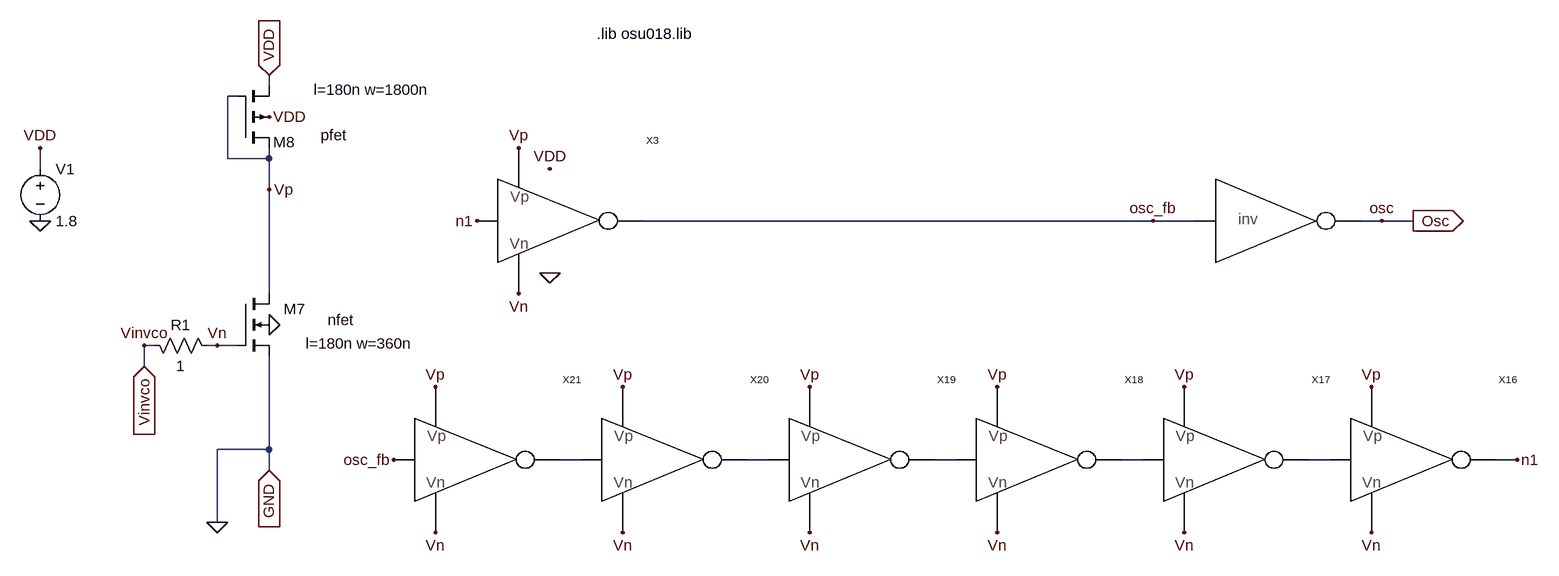
[diagram p0: schematic vco_19_16.asc]
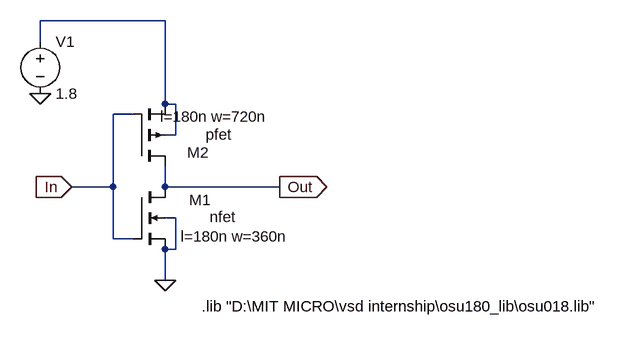
[diagram p1: sub-circuit inv_20_10.asc]
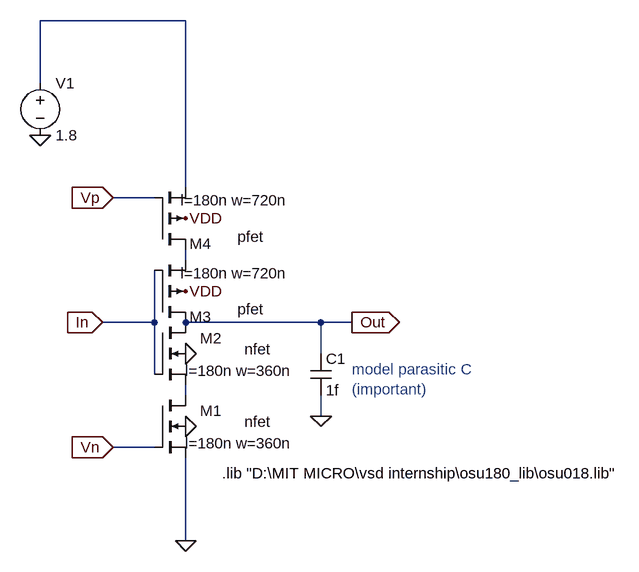
[diagram p2: sub-circuit cs_inv.asc]
vco_19_16.asc, the LTspice schematic file:
Version 4
SHEET 1 6288 680
WIRE 816 -976 816 -992
WIRE 768 -960 752 -960
WIRE 752 -864 752 -960
WIRE 816 -864 816 -880
WIRE 816 -864 752 -864
WIRE 464 -848 464 -880
WIRE 816 -816 816 -864
WIRE 2176 -768 1392 -768
WIRE 2240 -768 2176 -768
WIRE 2528 -768 2496 -768
WIRE 2576 -768 2528 -768
WIRE 816 -656 816 -816
WIRE 640 -576 624 -576
WIRE 736 -576 720 -576
WIRE 768 -576 736 -576
WIRE 624 -544 624 -576
WIRE 816 -416 816 -560
WIRE 816 -416 736 -416
WIRE 1296 -400 1264 -400
WIRE 1584 -400 1552 -400
WIRE 1872 -400 1840 -400
WIRE 2160 -400 2128 -400
WIRE 2448 -400 2416 -400
WIRE 2736 -400 2704 -400
WIRE 816 -384 816 -416
WIRE 736 -304 736 -416
FLAG 624 -576 Vinvco
FLAG 816 -608 0
FLAG 816 -928 VDD
FLAG 816 -816 Vp
FLAG 1072 -512 Vp
FLAG 1072 -288 Vn
FLAG 736 -576 Vn
FLAG 1360 -512 Vp
FLAG 1360 -288 Vn
FLAG 1648 -512 Vp
FLAG 1648 -288 Vn
FLAG 1936 -512 Vp
FLAG 1936 -288 Vn
FLAG 2224 -512 Vp
FLAG 2224 -288 Vn
FLAG 2512 -512 Vp
FLAG 2512 -288 Vn
FLAG 1248 -848 VDD
FLAG 1248 -688 0
FLAG 1200 -880 Vp
FLAG 1200 -656 Vn
FLAG 2528 -768 osc
FLAG 2176 -768 osc_fb
FLAG 1008 -400 osc_fb
FLAG 2736 -400 n1
FLAG 1136 -768 n1
FLAG 816 -992 VDD
IOPIN 816 -992 In
FLAG 816 -384 GND
IOPIN 816 -384 In
FLAG 624 -544 Vinvco
IOPIN 624 -544 In
FLAG 2576 -768 Osc
IOPIN 2576 -768 Out
FLAG 464 -768 0
FLAG 464 -880 VDD
FLAG 736 -304 0
SYMBOL nmos4 768 -656 R0
WINDOW 0 104 24 Right 2
WINDOW 3 179 41 Right 2
WINDOW 123 270 77 Right 2
SYMATTR InstName M7
SYMATTR Value nfet
SYMATTR Value2 l=180n w=360n
SYMBOL pmos4 768 -880 M180
WINDOW 0 88 9 Right 2
WINDOW 3 168 20 Right 2
WINDOW 123 296 90 Right 2
SYMATTR InstName M8
SYMATTR Value pfet
SYMATTR Value2 l=180n w=1800n
SYMBOL res 736 -560 M270
WINDOW 0 32 56 VTop 2
WINDOW 3 0 56 VBottom 2
SYMATTR InstName R1
SYMATTR Value 1
SYMBOL INV_20_10 2272 -832 R0
WINDOW 0 0 0 Invisible 0
SYMATTR InstName U22
SYMBOL CS_inv 1168 -832 R0
SYMATTR InstName X3
SYMBOL CS_inv 2480 -464 R0
SYMATTR InstName X16
SYMBOL CS_inv 2192 -464 R0
SYMATTR InstName X17
SYMBOL CS_inv 1904 -464 R0
SYMATTR InstName X18
SYMBOL CS_inv 1616 -464 R0
SYMATTR InstName X19
SYMBOL CS_inv 1328 -464 R0
SYMATTR InstName X20
SYMBOL CS_inv 1040 -464 R0
SYMATTR InstName X21
SYMBOL voltage 464 -864 R0
WINDOW 123 0 0 Left 0
WINDOW 39 0 0 Left 0
SYMATTR InstName V1
SYMATTR Value 1.8
TEXT 1320 -1056 Left 2 !.lib osu018.lib

inv_20_10.asc, the sub-circuit schematic file:
Version 4
SHEET 1 1196 680
WIRE 448 -432 256 -432
WIRE 256 -400 256 -432
WIRE 448 -304 448 -432
WIRE 464 -304 448 -304
WIRE 400 -288 368 -288
WIRE 464 -256 464 -304
WIRE 464 -256 448 -256
WIRE 368 -176 368 -288
WIRE 368 -176 304 -176
WIRE 448 -176 448 -208
WIRE 624 -176 448 -176
WIRE 464 -128 448 -128
WIRE 368 -96 368 -176
WIRE 400 -96 368 -96
WIRE 464 -80 464 -128
WIRE 464 -80 448 -80
WIRE 448 -32 448 -80
FLAG 304 -176 In
IOPIN 304 -176 In
FLAG 624 -176 Out
IOPIN 624 -176 Out
FLAG 448 -32 0
FLAG 256 -320 0
SYMBOL nmos4 400 -176 R0
WINDOW 0 119 20 Right 2
WINDOW 3 157 46 Right 2
WINDOW 123 238 76 Right 2
SYMATTR InstName M1
SYMATTR Value nfet
SYMATTR Value2 l=180n w=360n
SYMBOL pmos4 400 -208 M180
WINDOW 0 116 21 Right 2
WINDOW 3 151 49 Right 2
WINDOW 123 206 76 Right 2
SYMATTR InstName M2
SYMATTR Value pfet
SYMATTR Value2 l=180n w=720n
SYMBOL voltage 256 -416 R0
WINDOW 123 0 0 Left 0
WINDOW 39 0 0 Left 0
SYMATTR InstName V1
SYMATTR Value 1.8
TEXT 504 8 Left 2 !.lib "D:\\MIT MICRO\\vsd internship\\osu180_lib\\osu018.lib"

cs_inv.asc, the sub-circuit schematic file:
Version 4
SHEET 1 6288 680
WIRE 656 -752 432 -752
WIRE 432 -656 432 -752
WIRE 656 -496 656 -752
WIRE 608 -480 544 -480
WIRE 656 -384 656 -400
WIRE 608 -288 608 -368
WIRE 608 -288 528 -288
WIRE 864 -288 656 -288
WIRE 912 -288 864 -288
WIRE 864 -240 864 -288
WIRE 608 -208 608 -288
WIRE 656 -176 656 -192
WIRE 864 -144 864 -176
WIRE 608 -96 544 -96
WIRE 656 48 656 -80
FLAG 656 -128 0
FLAG 656 -448 VDD
FLAG 656 -336 VDD
FLAG 656 -240 0
FLAG 528 -288 In
IOPIN 528 -288 In
FLAG 544 -480 Vp
IOPIN 544 -480 In
FLAG 544 -96 Vn
IOPIN 544 -96 In
FLAG 912 -288 Out
IOPIN 912 -288 Out
FLAG 864 -144 0
FLAG 432 -576 0
FLAG 656 48 0
SYMBOL nmos4 608 -176 R0
WINDOW 0 104 24 Right 2
WINDOW 3 179 41 Right 2
WINDOW 123 213 74 Right 2
SYMATTR InstName M1
SYMATTR Value nfet
SYMATTR Value2 l=180n w=360n
SYMBOL pmos4 608 -400 M180
WINDOW 0 88 9 Right 2
WINDOW 3 168 20 Right 2
WINDOW 123 206 76 Right 2
SYMATTR InstName M4
SYMATTR Value pfet
SYMATTR Value2 l=180n w=720n
SYMBOL pmos4 608 -288 M180
WINDOW 0 88 9 Right 2
WINDOW 3 168 20 Right 2
WINDOW 123 206 76 Right 2
SYMATTR InstName M3
SYMATTR Value pfet
SYMATTR Value2 l=180n w=720n
SYMBOL nmos4 608 -288 R0
WINDOW 0 104 24 Right 2
WINDOW 3 179 41 Right 2
WINDOW 123 213 74 Right 2
SYMATTR InstName M2
SYMATTR Value nfet
SYMATTR Value2 l=180n w=360n
SYMBOL cap 848 -240 R0
SYMATTR InstName C1
SYMATTR Value 1f
SYMBOL voltage 432 -672 R0
WINDOW 123 0 0 Left 0
WINDOW 39 0 0 Left 0
SYMATTR InstName V1
SYMATTR Value 1.8
TEXT 712 -56 Left 2 !.lib "D:\\MIT MICRO\\vsd internship\\osu180_lib\\osu018.lib"
TEXT 912 -216 Left 2 ;model parasitic C\n(important)

The netlist it stands for:
* vco_19_16.asc
M7 Vp Vn 0 0 nfet l=180n w=360n
M8 Vp Vp VDD VDD pfet l=180n w=1800n
R1 Vn Vinvco 1
XU22 osc_fb osc inv_20_10
XX3 n1 osc_fb Vp Vn cs_inv
XX16 N005 n1 Vp Vn cs_inv
XX17 N004 N005 Vp Vn cs_inv
XX18 N003 N004 Vp Vn cs_inv
XX19 N002 N003 Vp Vn cs_inv
XX20 N001 N002 Vp Vn cs_inv
XX21 osc_fb N001 Vp Vn cs_inv
V1 VDD 0 1.8

* block symbol definitions
.subckt inv_20_10 In Out
M1 Out In 0 0 nfet l=180n w=360n
M2 Out In N001 N001 pfet l=180n w=720n
V1 N001 0 1.8
.lib "D:\MIT MICRO\vsd internship\osu180_lib\osu018.lib"
.ends inv_20_10

.subckt cs_inv In Out Vp Vn
M1 N003 Vn 0 0 nfet l=180n w=360n
M4 N002 Vp N001 VDD pfet l=180n w=720n
M3 Out In N002 VDD pfet l=180n w=720n
M2 Out In N003 0 nfet l=180n w=360n
C1 Out 0 1f
V1 N001 0 1.8
.lib "D:\MIT MICRO\vsd internship\osu180_lib\osu018.lib"
* model parasitic C
* (important)
.ends cs_inv

.model NMOS NMOS
.model PMOS PMOS
.lib standard.mos
.lib osu018.lib
.backanno
.end